# EAGLE schematic RaspPi Counter (EAGLE 7.2.0)
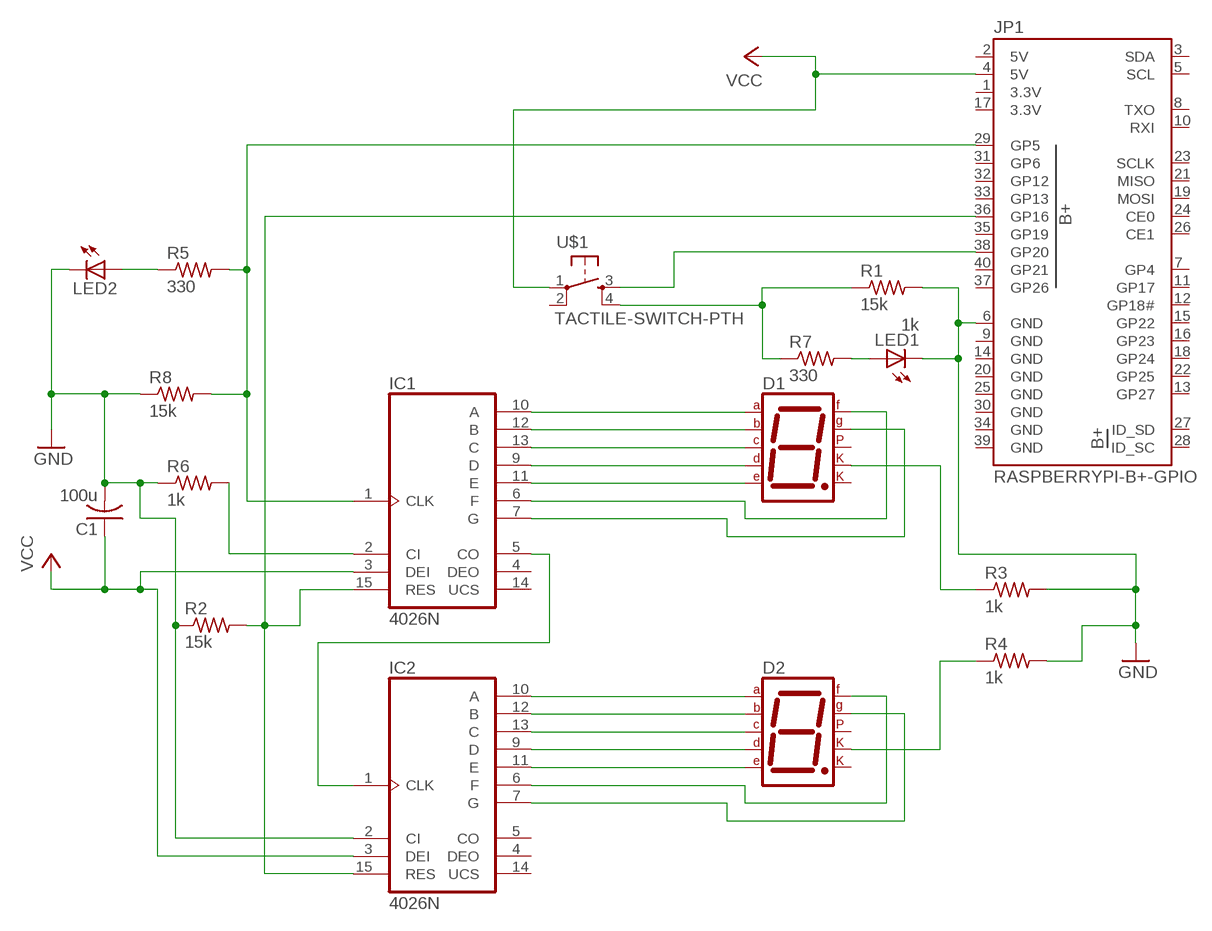
[diagram p0: schematic, sheet 1]

## Parts
C1  100u  C-US025-024X044  [C025-024X044]
D1  7SEG-CK  [7SEG-13]
D2  7SEG-CK  [7SEG-13]
IC1  4026N  [DIL16]
IC2  4026N  [DIL16]
JP1  RASPBERRYPI-B+-GPIO  [2X20-SHROUDED]
LED1  1k  LED3MM  [LED3MM]
LED2  LED3MM  [LED3MM]
R1  15k  R-US_0204/2V  [0204V]
R2  15k  R-US_0204/2V  [0204V]
R3  1k  R-US_0204/2V  [0204V]
R4  1k  R-US_0204/2V  [0204V]
R5  330  R-US_0204/2V  [0204V]
R6  1k  R-US_0204/2V  [0204V]
R7  330  R-US_0204/2V  [0204V]
R8  15k  R-US_0204/2V  [0204V]
U$1  TACTILE-SWITCH-PTH  [TAC-SWITCH-PTH]

## Nets
GND: C1.2 IC2.2(CI) JP1.6(GND) LED1.K(C) LED2.K(C) R1.2 R2.1 R3.2 R4.2 R6.1 R8.1
N$1: D1.7(A) IC1.10(A)
N$2: D1.6(B) IC1.12(B)
N$3: D1.4(C) IC1.13(C)
N$4: D1.2(D) IC1.9(D)
N$5: D1.1(E) IC1.11(E)
N$6: D1.9(F) IC1.6(F)
N$7: D1.10(G) IC1.7(G)
N$8: D2.7(A) IC2.10(A)
N$9: D2.6(B) IC2.12(B)
N$10: D2.4(C) IC2.13(C)
N$11: D2.2(D) IC2.9(D)
N$12: D2.1(E) IC2.11(E)
N$13: D2.9(F) IC2.6(F)
N$14: D2.10(G) IC2.7(G)
N$15: IC1.5(CO) IC2.1(CLK)
N$16: IC1.1(CLK) JP1.29(GP5) R5.2 R8.2
N$18: D1.3(CK1) R3.1
N$19: D2.3(CK1) R4.1
N$20: R1.1 R7.1 U$1.4
N$21: LED2.A R5.1
N$22: IC1.15(RES) IC2.15(RES) JP1.36(GP16) R2.2
N$23: IC1.2(CI) R6.2
N$24: JP1.38(GP20) U$1.3
N$28: LED1.A R7.2
VCC: C1.1 IC1.3(DEI) IC2.3(DEI) JP1.4(5V) U$1.1
Unconnected: D1.5(DP) D1.8(CK2) D2.5(DP) D2.8(CK2) IC1.4(DEO) IC1.14(UCS) IC2.4(DEO) IC2.5(CO) IC2.14(UCS) JP1.3(SDA) JP1.5(SCL) JP1.7(GP4) JP1.8(TXO) JP1.10(RXI) JP1.11(GP17) JP1.12(GP18#) JP1.13(GP27) JP1.15(GP22) JP1.16(GP23) JP1.18(GP24) JP1.19(MOSI) JP1.21(MISO) JP1.22(GP25) JP1.23(SCLK) JP1.24(CE0) JP1.26(CE1) JP1.27(ID_SD) JP1.28(ID_SC) JP1.31(GP6) JP1.32(GP12) JP1.33(GP13) JP1.35(GP19) JP1.37(GP26) JP1.40(GP21) U$1.2

## Power pins joined to a net without a drawn wire
3.3V: JP1.1(3.3V) JP1.17(3.3V)
5V: JP1.2(5V)
GND: JP1.9(GND) JP1.14(GND) JP1.20(GND) JP1.25(GND) JP1.30(GND) JP1.34(GND) JP1.39(GND)
VDD: IC1.16(VDD) IC2.16(VDD)
VSS: IC1.8(VSS) IC2.8(VSS)

## Library data of the parts
C1 = resistor:C-US: CAPACITOR, American symbol
D1 D2 = special:7SEG-CK: 7-segment DISPLAY single cathode, 13 mm
IC1 IC2 = 40xx:4026: Decade COUNTER/DIVIDER, 7-seg. outputs
JP1 = SparkFun-Boards:RASPBERRYPI-B+-GPIO: Raspberry Pi B+ GPIO Header 2x20 pin connector
LED1 LED2 = adafruit:LED: LED OSRAM: - CHIPLED LG R971, LG N971, LY N971, LG Q971, LY Q971, LO R971, LY R971 LH N974, LH R974 LS Q976, LO Q976, LY Q976 LO Q996 - Hyper CHIPLED LW Q18S LB Q993, LB Q99A, LB R99A - SideLED LS A670, LO A670, LY A670, LG A670, LP A670 LB A673, LV A673, LT A673, LW A673 LH A674 LY A675 LS A676, LA A676, LO A676, LY A676, LW A676 LS A679, LY A679, LG A679 - Hyper Micro SIDELED® LS Y876, LA Y876, LO Y876, LY Y876 LT Y87S - SmartLED LW L88C, LW L88S LB L89C, LB L89S, LG L890 LS L89K, LO L89K, LY L89K LS L896, LA L896, LO L896, LY L896 - TOPLED LS T670, LO T670, LY T670, LG T670, LP T670 LSG T670, LSP T670, LSY T670, LOP T670, LYG T670 LG T671, LOG T671, LSG T671 LB T673, LV T673, LT T673, LW T673 LH T674 LS T676, LA T676, LO T676, LY T676, LB T676, LH T676, LSB T676, LW T676 LB T67C, LV T67C, LT T67C, LS T67K, LO T67K, LY T67K, LW E67C LS E67B, LA E67B, LO E67B, LY E67B, LB E67C, LV E67C, LT E67C LW T67C LS T679, LY T679, LG T679 LS T770, LO T770, LY T770, LG T770, LP T770 LB T773, LV T773, LT T773, LW T773 LH T774 LS E675, LA E675, LY E675, LS T675 LS T776, LA T776, LO T776, LY T776, LB T776 LHGB T686 LT T68C, LB T68C - Hyper Mini TOPLED® LB M676 - Mini TOPLED Santana® LG M470 LS M47K, LO M47K, LY M47K Source: http://www.osram.convergy.de/
R1-R8 = resistor:R-US_: RESISTOR, American symbol
U$1 = GeekAmmo:TACTILE-SWITCH: Tactile Switch 4 Pins, SPST NO